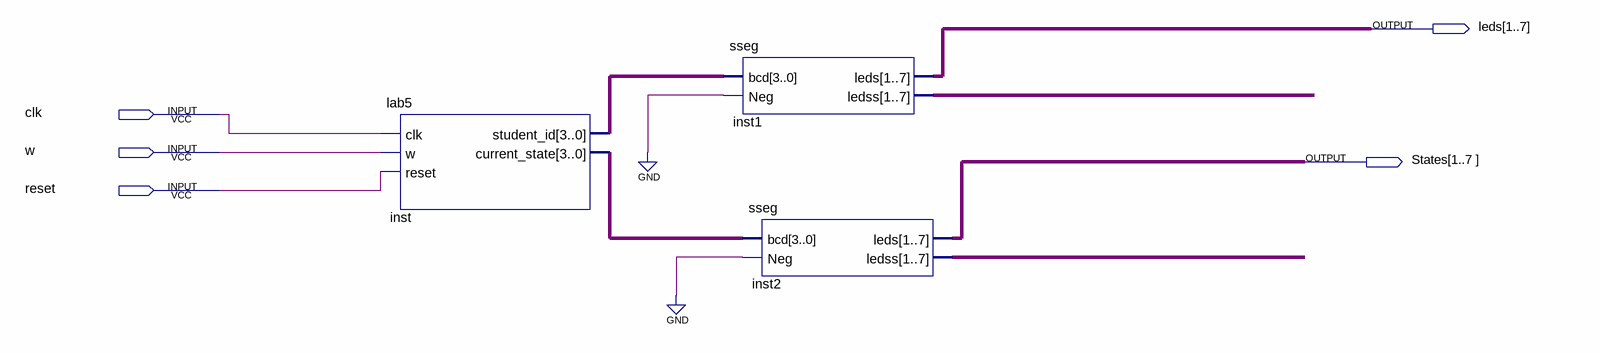
[diagram p0: schematic sheet]
// Quartus schematic moore.bdf as structural Verilog: 3 symbols, 5 pins
module moore (
  input  clk,
  input  w,
  input  reset,
  output [1:7] leds,
  output [1:7] States
);

  wire [3:0] inst_current_state, inst_student_id;
  wire [6:0] inst1_ledss, inst2_ledss;

  lab5 inst (.clk(clk), .w(w), .reset(reset), .student_id(inst_student_id), .current_state(inst_current_state));
  sseg inst1 (.bcd(inst_student_id), .Neg(1'b0), .leds(leds), .ledss(inst1_ledss));
  sseg inst2 (.bcd(inst_current_state), .Neg(1'b0), .leds(States), .ledss(inst2_ledss));
endmodule
